# EAGLE design WireConnector (EAGLE 7.7.0)
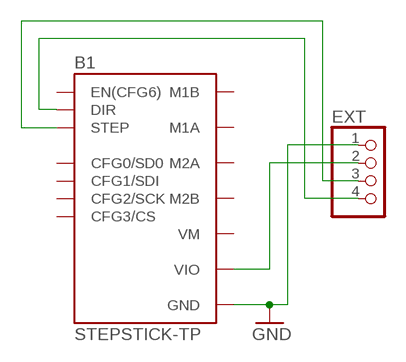
[diagram p0: schematic, sheet 1]

## Parts
B1  STEPSTICK-TP  [STEPSTICK_TP]
EXT  PINHD-1X4  [1X04]

## Nets
GND [PWR]: B1.GND@1(GND) B1.GND@2(GND) EXT.1
N$2 [PWR]: B1.VIO EXT.2
N$3 [Signal]: B1.STEP EXT.3
N$4 [PWR]: B1.DIR EXT.4
Unconnected: B1.CFG1(CFG1/SDI) B1.CFG2(CFG2/SCK) B1.CFG3(CFG3/CS) B1.EN(EN(CFG6)) B1.M1A B1.M1B B1.M2A B1.M2B B1.NC(CFG0/SD0) B1.NC/CFG0(CFG0/SD0)

## Power pins joined to a net without a drawn wire
VM: B1.VM

## Library data of the parts
B1 = we-board:STEPSTICK: SilentStepStick - Trinamic TMC2100/TMC2130 Stepper Motor Driver TMC2100 - CFG pins for configuration TMC2130 - SPI for configuration Pin CFG0/SDO only available on TMC2130 SilentStepStick.
EXT = pinhead:PINHD-1X4: PIN HEADER

## Net classes
1 Signal: width 0.254 mm
2 PWR: width 0.508 mm

## Board
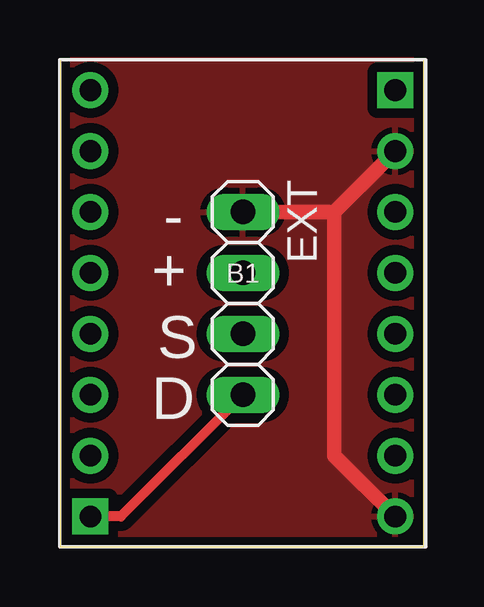
[diagram p1: board, top side]
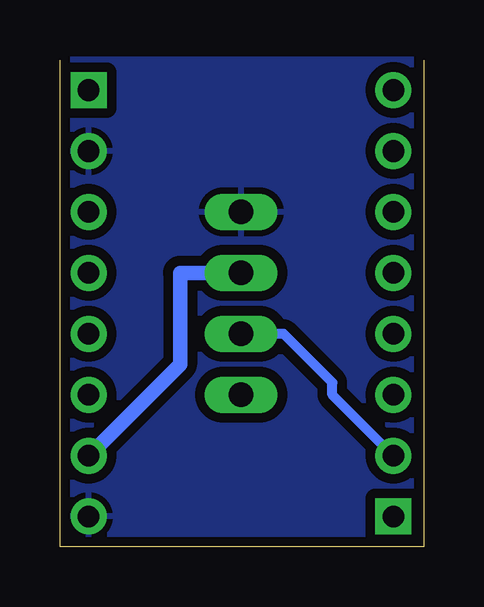
[diagram p2: board, bottom side, seen from below]

Size 15.16 x 20.31 mm. Coordinates in mm from the lower left corner, seen from the top.
Outline: 15.16,20.31 15.16,0 0,0 0,20.31
Copper layers (1*16): Top 0.035mm / dielectric 1.5mm / Bottom 0.035mm
Design rules "default *": minimum track width 10mil, minimum drill 24mil, track to track 8mil, track to pad 8mil, pad to pad 8mil, via to via 8mil, smd to smd 8mil, copper to edge 10mil, drill to drill 8mil, minimum pad ring 10mil, minimum via ring 8mil, stop-mask expansion 4mil, vias tented up to drill 0mil, thermal gap 10mil

### Footprints (pad centres in the part's own frame; a part is rotated, then mirrored left to right if it is on the bottom)
STEPSTICK_TP = drill 0.9 pad 1.5: CFG1 -6.35,6.35; CFG2 -6.35,3.81; CFG3 -6.35,1.27; EN -6.35,8.89; GND@1 6.35,6.35; GND@2 6.35,-8.89; M1A 6.35,-1.27; M1B 6.35,-3.81; M2A 6.35,1.27; M2B 6.35,3.81; NC -6.35,-3.81; NC/CFG0 -6.35,-1.27; STEP -6.35,-6.35; VIO 6.35,-6.35 | drill 0.9 pad 1.5 square: DIR -6.35,-8.89; VM 6.35,8.89
1X04 = drill 1.016 long: 1 -3.81,0; 2 -1.27,0; 3 1.27,0; 4 3.81,0

### Placement (x,y rotation side)
B1  7.62,10.16 0 top
EXT  7.62,10.16 270 top

### Tracks (layer width: path | path; a pad name or v marks a point on that pad's centre or on a via)
GND
  Top 0.61: EXT.1 11.43,13.97 | 11.43,13.97 B1.GND@1 | 11.43,13.97 11.43,3.81 B1.GND@2
  pour Bottom (isolate 0.406): 0,20.32 15.24,20.32 15.24,0 0,0
  pour Top (isolate 0.406): 15.24,0 3.56,0 0,0
  pour Top (isolate 0.406): 0,20.32 15.24,20.32 15.24,5.33 15.24,0 1.27,0 0,0
N$2
  Bottom 0.61: EXT.2 10.16,11.43 10.16,7.62 B1.VIO
N$3
  Bottom 0.406: B1.STEP 3.81,6.35 3.81,6.86 5.84,8.89 EXT.3
N$4
  Top 0.406: EXT.4 2.54,1.27 B1.DIR

### Text on the board
tNames: - | + | S | D